# EAGLE design 6309 CPU Card v3 (EAGLE 4.16)
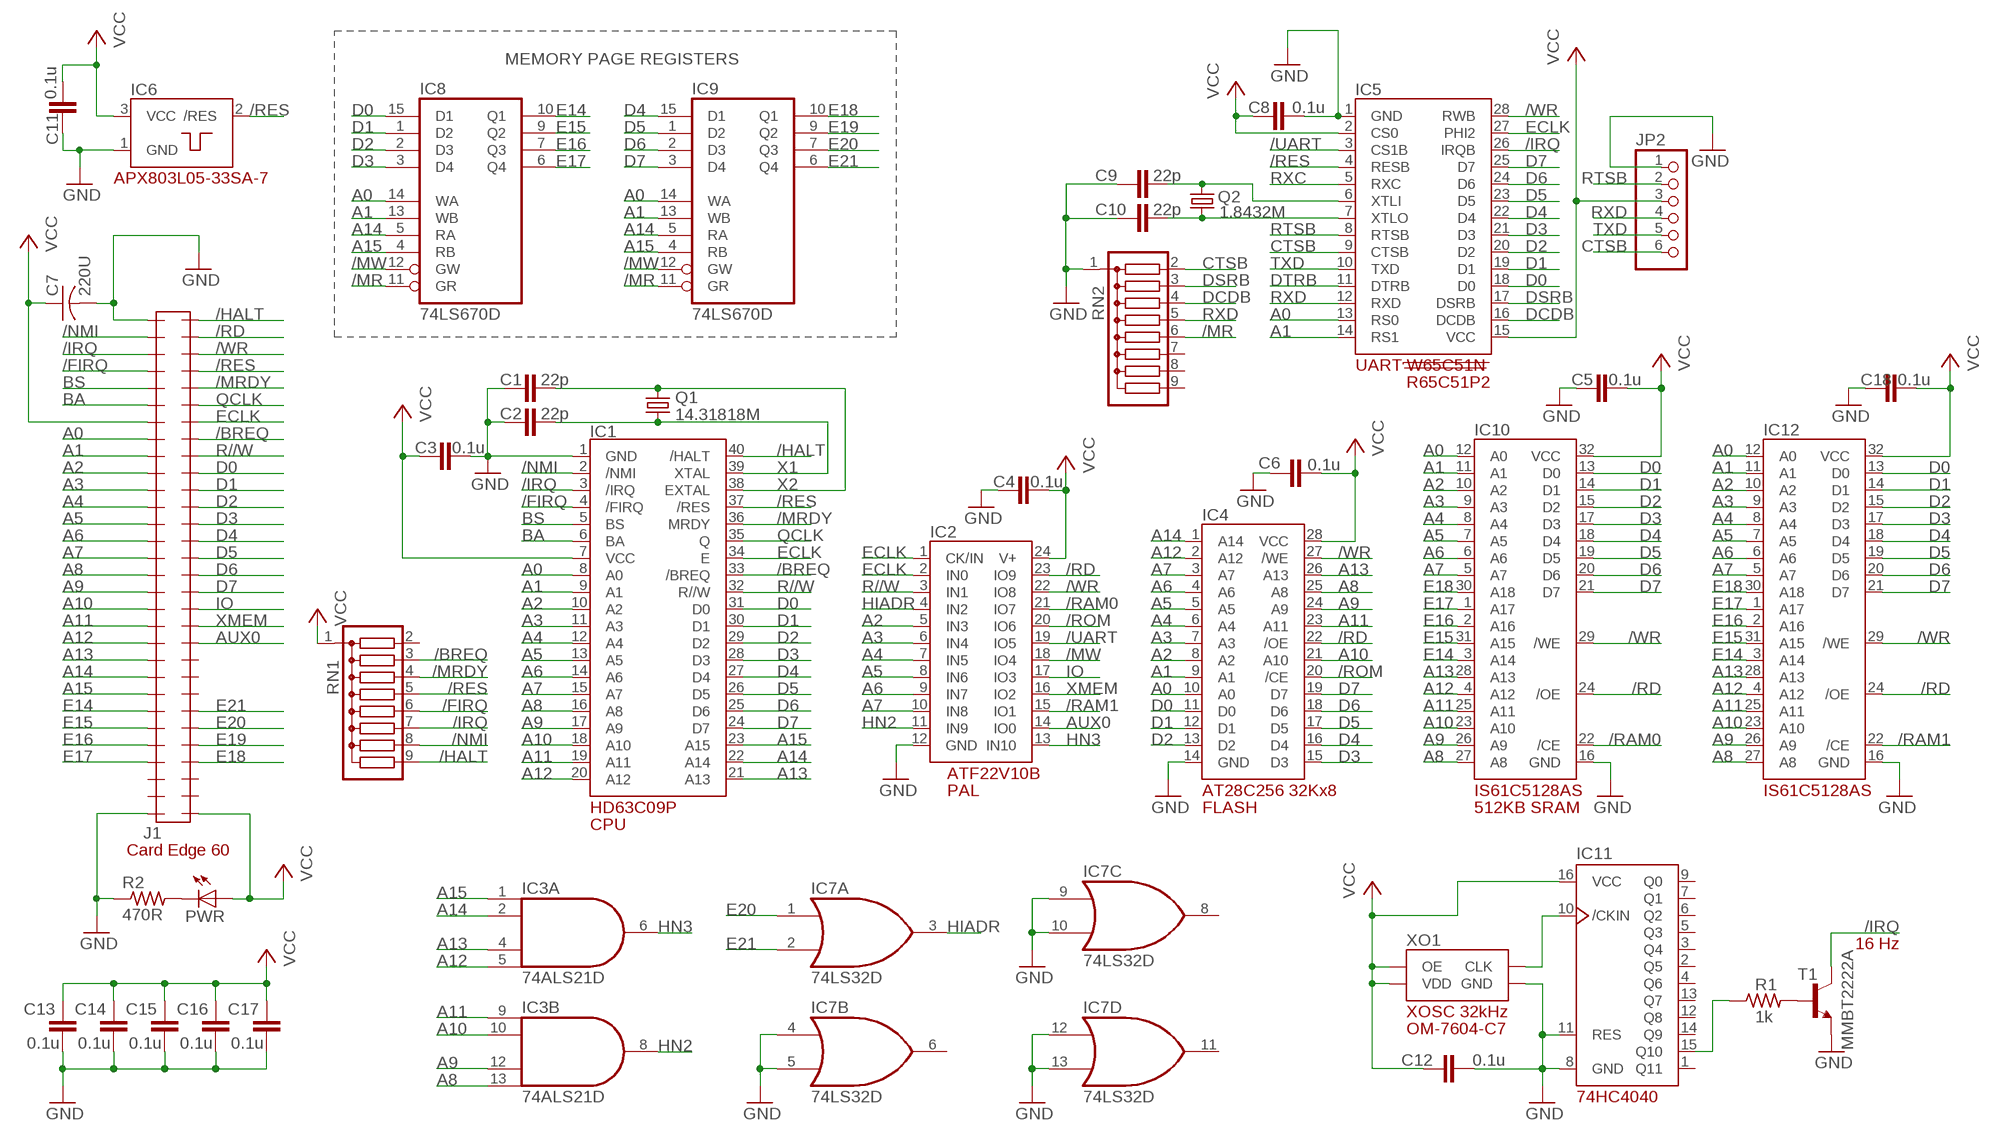
[diagram p0: schematic, sheet 1]

## Parts
C1  22p  C-EUC0603  [C0603]
C2  22p  C-EUC0603  [C0603]
C3  0.1u  C-EUC0603  [C0603]
C4  0.1u  C-EUC0603  [C0603]
C5  0.1u  C-EUC0603  [C0603]
C6  0.1u  C-EUC0603  [C0603]
C7  220U  C-US025-050X050  [C025-050X050]
C8  0.1u  C-EUC0603  [C0603]
C9  22p  C-EUC0603  [C0603]
C10  22p  C-EUC0603  [C0603]
C11  0.1u  C-EUC0603  [C0603]
C12  0.1u  C-EUC0603  [C0603]
C13  0.1u  C-EUC0603  [C0603]
C14  0.1u  C-EUC0603  [C0603]
C15  0.1u  C-EUC0603  [C0603]
C16  0.1u  C-EUC0603  [C0603]
C17  0.1u  C-EUC0603  [C0603]
C18  0.1u  C-EUC0603  [C0603]
IC1  HD63C09P  [DIL40]
IC2  PLD_ATF22V10B  [DIL24-3]
IC3  74ALS21D  [SO14]
IC4  EEP_32KX8_AT28C256  [DIL28-6]
IC5  UART_W65C51N  [DIL28-6]
IC6  POR_APX803L05-33SA-7  [SOT23]
IC7  74LS32D  [SO14]
IC8  74LS670D  [SO16]
IC9  74LS670D  [SO16]
IC10  IS61C5128AS  [SOIC32_11.3MM_WID]
IC11  74HC4040D  [SO16]
IC12  IS61C5128AS  [SOIC32_11.3MM_WID]
J1  CARDEDGE_2.54_60POS  [CARDEDGE_2.54_60POS]
JP2  PINHD-1X6  [1X06]
PWR  LED3MM  [LED3MM]
Q1  14.31818M  CRYSTALHC49S  [HC49/S]
Q2  1.8432M  CRYSTALHC49S  [HC49/S]
R1  1k  R-US_R0603  [R0603]
R2  470R  R-US_R0603  [R0603]
RN1  G08R  [SIL9]
RN2  G08R  [SIL9]
T1  MMBT2222A  MMBT2222ALT1-NPN-SOT23-BEC  [SOT23-BEC]
XO1  XODC_32KHZ_OM-7604-C7  [32K_XO_OM-7604-C7]

## Nets
/BREQ: IC1.33(/BREQ) J1.53 RN1.3
/FIRQ: IC1.4(/FIRQ) J1.4 RN1.6
/HALT: IC1.40(/HALT) J1.60 RN1.9
/IRQ: IC1.3(/IRQ) IC5.26(IRQB) J1.3 RN1.7 T1.C
/MR: IC8.11(GR) IC9.11(GR) RN2.6
/MRDY: IC1.36(MRDY) J1.56 RN1.4
/MW: IC2.18(IO4) IC8.12(GW) IC9.12(GW)
/NMI: IC1.2(/NMI) J1.2 RN1.8
/RAM0: IC2.21(IO7) IC10.22(/CE)
/RAM1: IC2.15(IO1) IC12.22(/CE)
/RD: IC2.23(IO9) IC4.22(/OE) IC10.24(/OE) IC12.24(/OE) J1.59
/RES: IC1.37(/RES) IC5.4(RESB) IC6.2(/RES) J1.57 RN1.5
/ROM: IC2.20(IO6) IC4.20(/CE)
/UART: IC2.19(IO5) IC5.3(CS1B)
/WR: IC2.22(IO8) IC4.27(/WE) IC5.28(RWB) IC10.29(/WE) IC12.29(/WE) J1.58
A0: IC1.8(A0) IC4.10(A0) IC5.13(RS0) IC8.14(WA) IC9.14(WA) IC10.12(A0) IC12.12(A0) J1.8
A1: IC1.9(A1) IC4.9(A1) IC5.14(RS1) IC8.13(WB) IC9.13(WB) IC10.11(A1) IC12.11(A1) J1.9
A2: IC1.10(A2) IC2.5(IN3) IC4.8(A2) IC10.10(A2) IC12.10(A2) J1.10
A3: IC1.11(A3) IC2.6(IN4) IC4.7(A3) IC10.9(A3) IC12.9(A3) J1.11
A4: IC1.12(A4) IC2.7(IN5) IC4.6(A4) IC10.8(A4) IC12.8(A4) J1.12
A5: IC1.13(A5) IC2.8(IN6) IC4.5(A5) IC10.7(A5) IC12.7(A5) J1.13
A6: IC1.14(A6) IC2.9(IN7) IC4.4(A6) IC10.6(A6) IC12.6(A6) J1.14
A7: IC1.15(A7) IC2.10(IN8) IC4.3(A7) IC10.5(A7) IC12.5(A7) J1.15
A8: IC1.16(A8) IC3.13(B:I3) IC4.25(A8) IC10.27(A8) IC12.27(A8) J1.16
A9: IC1.17(A9) IC3.12(B:I2) IC4.24(A9) IC10.26(A9) IC12.26(A9) J1.17
A10: IC1.18(A10) IC3.10(B:I1) IC4.21(A10) IC10.23(A10) IC12.23(A10) J1.18
A11: IC1.19(A11) IC3.9(B:I0) IC4.23(A11) IC10.25(A11) IC12.25(A11) J1.19
A12: IC1.20(A12) IC3.5(A:I3) IC4.2(A12) IC10.4(A12) IC12.4(A12) J1.20
A13: IC1.21(A13) IC3.4(A:I2) IC4.26(A13) IC10.28(A13) IC12.28(A13) J1.21
A14: IC1.22(A14) IC3.2(A:I1) IC4.1(A14) IC8.5(RA) IC9.5(RA) J1.22
A15: IC1.23(A15) IC3.1(A:I0) IC8.4(RB) IC9.4(RB) J1.23
AUX0: IC2.14(IO0) J1.41
BA: IC1.6(BA) J1.6
BS: IC1.5(BS) J1.5
CTSB: IC5.9(CTSB) JP2.6 RN2.2
D0: IC1.31(D0) IC4.11(D0) IC5.18(D0) IC8.15(D1) IC10.13(D0) IC12.13(D0) J1.51
D1: IC1.30(D1) IC4.12(D1) IC5.19(D1) IC8.1(D2) IC10.14(D1) IC12.14(D1) J1.50
D2: IC1.29(D2) IC4.13(D2) IC5.20(D2) IC8.2(D3) IC10.15(D2) IC12.15(D2) J1.49
D3: IC1.28(D3) IC4.15(D3) IC5.21(D3) IC8.3(D4) IC10.17(D3) IC12.17(D3) J1.48
D4: IC1.27(D4) IC4.16(D4) IC5.22(D4) IC9.15(D1) IC10.18(D4) IC12.18(D4) J1.47
D5: IC1.26(D5) IC4.17(D5) IC5.23(D5) IC9.1(D2) IC10.19(D5) IC12.19(D5) J1.46
D6: IC1.25(D6) IC4.18(D6) IC5.24(D6) IC9.2(D3) IC10.20(D6) IC12.20(D6) J1.45
D7: IC1.24(D7) IC4.19(D7) IC5.25(D7) IC9.3(D4) IC10.21(D7) IC12.21(D7) J1.44
DCDB: IC5.16(DCDB) RN2.4
DSRB: IC5.17(DSRB) RN2.3
DTRB: IC5.11(DTRB)
E14: IC8.10(Q1) IC10.3(A14) IC12.3(A14) J1.24
E15: IC8.9(Q2) IC10.31(A15) IC12.31(A15) J1.25
E16: IC8.7(Q3) IC10.2(A16) IC12.2(A16) J1.26
E17: IC8.6(Q4) IC10.1(A17) IC12.1(A17) J1.27
E18: IC9.10(Q1) IC10.30(A18) IC12.30(A18) J1.34
E19: IC9.9(Q2) J1.35
E20: IC7.1(A:I0) IC9.7(Q3) J1.36
E21: IC7.2(A:I1) IC9.6(Q4) J1.37
ECLK: IC1.34(E) IC2.1(CK/IN) IC2.2(IN0) IC5.27(PHI2) J1.54
GND [supply]: C1.1 C2.1 C3.2 C4.1 C5.1 C6.1 C7.2 C8.2 C9.1 C10.1 C11.2 C12.2 C13.2 C14.2 C15.2 C16.2 C17.2 C18.1 IC1.1(GND) IC2.12(GND) IC4.14(GND) IC5.1(GND) IC6.1(GND) IC7.4(B:I0) IC7.5(B:I1) IC7.9(C:I0) IC7.10(C:I1) IC7.12(D:I0) IC7.13(D:I1) IC10.16(GND) IC11.8(GND) IC11.11(RES) IC12.16(GND) J1.1 J1.30 JP2.1 R2.1 RN2.1 T1.E XO1.GND
HIADR: IC2.4(IN2) IC7.3(A:O)
HN2: IC2.11(IN9) IC3.8(B:O)
HN3: IC2.13(IN10) IC3.6(A:O)
IO: IC2.17(IO3) J1.43
N$1: R1.2 T1.B
N$2: PWR.K(C) R2.2
N$3: IC11.15(Q10) R1.1
N$5: IC11.10(/CKIN) XO1.CKOUT(CLK)
N$20: C9.2 IC5.6(XTLI) Q2.2
N$21: C10.2 IC5.7(XTLO) Q2.1
QCLK: IC1.35(Q) J1.55
R//W: IC1.32(R//W) IC2.3(IN1) J1.52
RTSB: IC5.8(RTSB) JP2.2
RXC: IC5.5(RXC)
RXD: IC5.12(RXD) JP2.4 RN2.5
TXD: IC5.10(TXD) JP2.5
VCC [supply]: C3.1 C4.2 C5.2 C6.2 C7.1 C8.1 C11.1 C12.1 C13.1 C14.1 C15.1 C16.1 C17.1 C18.2 IC1.7(VCC) IC2.24(V+) IC4.28(VCC) IC5.2(CS0) IC5.15(VCC) IC6.3(VCC) IC10.32(VCC) IC11.16(VCC) IC12.32(VCC) J1.7 J1.31 JP2.3 PWR.A RN1.1 XO1.OE XO1.VDD
X1: C2.2 IC1.39(XTAL) Q1.1
X2: C1.2 IC1.38(EXTAL) Q1.2
XMEM: IC2.16(IO2) J1.42
Unconnected: IC7.6(B:O) IC7.8(C:O) IC7.11(D:O) IC11.1(Q11) IC11.2(Q5) IC11.3(Q4) IC11.4(Q6) IC11.5(Q3) IC11.6(Q2) IC11.7(Q1) IC11.9(Q0) IC11.12(Q8) IC11.13(Q7) IC11.14(Q9) J1.28 J1.29 J1.32 J1.33 J1.38 J1.39 J1.40 RN1.2 RN2.7 RN2.8 RN2.9

## Notes on the sheet
- MEMORY PAGE REGISTERS
- R65C51P2
- PAL
- FLASH | 512KB SRAM
- CPU
- 16 Hz

## Power pins joined to a net without a drawn wire
GND: IC3.7(P:GND) IC7.7(P:GND) IC8.8(GND) IC9.8(GND)
VCC: IC3.14(P:VCC) IC7.14(P:VCC) IC8.16(VCC) IC9.16(VCC)

## Library data of the parts
C1-C6 C8-C18 = rcl:C-EU: CAPACITOR, European symbol
C7 = rcl:C-US: CAPACITOR, American symbol
IC1 = 07-Retrocomputing:HD63C09P
IC2 = 07-Retrocomputing:PLD_ATF22V10B
IC3 = 74xx-us:74*21: Dual 4-input AND gate
IC4 = 07-Retrocomputing:EEP_32KX8_AT28C256
IC5 = 07-Retrocomputing:UART_W65C51N
IC6 = 07-Retrocomputing:POR_APX803L05-33SA-7
IC7 = 74xx-us:74*32: Quad 2-input OR gate
IC8 IC9 = 74xx-us:74*670: 4 by 4 REGISTER FILES, 3-state
IC10 IC12 = 07-Retrocomputing:IS61C5128AS
IC11 = 07-Retrocomputing:74HC4040
J1 = 07-Retrocomputing:CARDEDGE_2.54_60POS
JP2 = pinhead:PINHD-1X6: PIN HEADER
PWR = led:LED: LED OSRAM: - CHIPLED LG R971, LG N971, LY N971, LG Q971, LY Q971, LO R971, LY R971 LH N974, LH R974 LS Q976, LO Q976, LY Q976 LO Q996 - Hyper CHIPLED LW Q18S LB Q993, LB Q99A, LB R99A - SideLED LS A670, LO A670, LY A670, LG A670, LP A670 LB A673, LV A673, LT A673, LW A673 LH A674 LY A675 LS A676, LA A676, LO A676, LY A676, LW A676 LS A679, LY A679, LG A679 - Hyper Micro SIDELED® LS Y876, LA Y876, LO Y876, LY Y876 LT Y87S - SmartLED LW L88C, LW L88S LB L89C, LB L89S, LG L890 LS L89K, LO L89K, LY L89K LS L896, LA L896, LO L896, LY L896 - TOPLED LS T670, LO T670, LY T670, LG T670, LP T670 LSG T670, LSP T670, LSY T670, LOP T670, LYG T670 LG T671, LOG T671, LSG T671 LB T673, LV T673, LT T673, LW T673 LH T674 LS T676, LA T676, LO T676, LY T676, LB T676, LH T676, LSB T676, LW T676 LB T67C, LV T67C, LT T67C, LS T67K, LO T67K, LY T67K, LW E67C LS E67B, LA E67B, LO E67B, LY E67B, LB E67C, LV E67C, LT E67C LW T67C LS T679, LY T679, LG T679 LS T770, LO T770, LY T770, LG T770, LP T770 LB T773, LV T773, LT T773, LW T773 LH T774 LS E675, LA E675, LY E675, LS T675 LS T776, LA T776, LO T776, LY T776, LB T776 LHGB T686 LT T68C, LB T68C - Hyper Mini TOPLED® LB M676 - Mini TOPLED Santana® LG M470 LS M47K, LO M47K, LY M47K Source: http://www.osram.convergy.de - LUMILED® LXK2-PW12-R00, LXK2-PW12-S00, LXK2-PW14-U00, LXK2-PW14-V00 LXK2-PM12-R00, LXK2-PM12-S00, LXK2-PM14-U00 LXK2-PE12-Q00, LXK2-PE12-R00, LXK2-PE12-S00, LXK2-PE14-T00, LXK2-PE14-U00 LXK2-PB12-K00, LXK2-PB12-L00, LXK2-PB12-M00, LXK2-PB14-N00, LXK2-PB14-P00, LXK2-PB14-Q00 LXK2-PR12-L00, LXK2-PR12-M00, LXK2-PR14-Q00, LXK2-PR14-R00 LXK2-PD12-Q00, LXK2-PD12-R00, LXK2-PD12-S00 LXK2-PH12-R00, LXK2-PH12-S00 LXK2-PL12-P00, LXK2-PL12-Q00, LXK2-PL12-R00 Source: www.luxeon.com
Q1 Q2 = crystal:CRYSTAL: CRYSTAL
R1 R2 = rcl:R-US_: RESISTOR, American symbol
RN1 RN2 = resistor-sil:G08R: SIL RESISTOR
T1 = transistor:*-NPN-: NPN Transistror
XO1 = 07-Retrocomputing:XODC_32KHZ_OM-7604-C7

## Net classes
0 default: width 0.203 mm, drill 0.203 mm, clearance 0.254 mm
1 supply: width 0.61 mm, drill 0.203 mm, clearance 0.305 mm

## Board
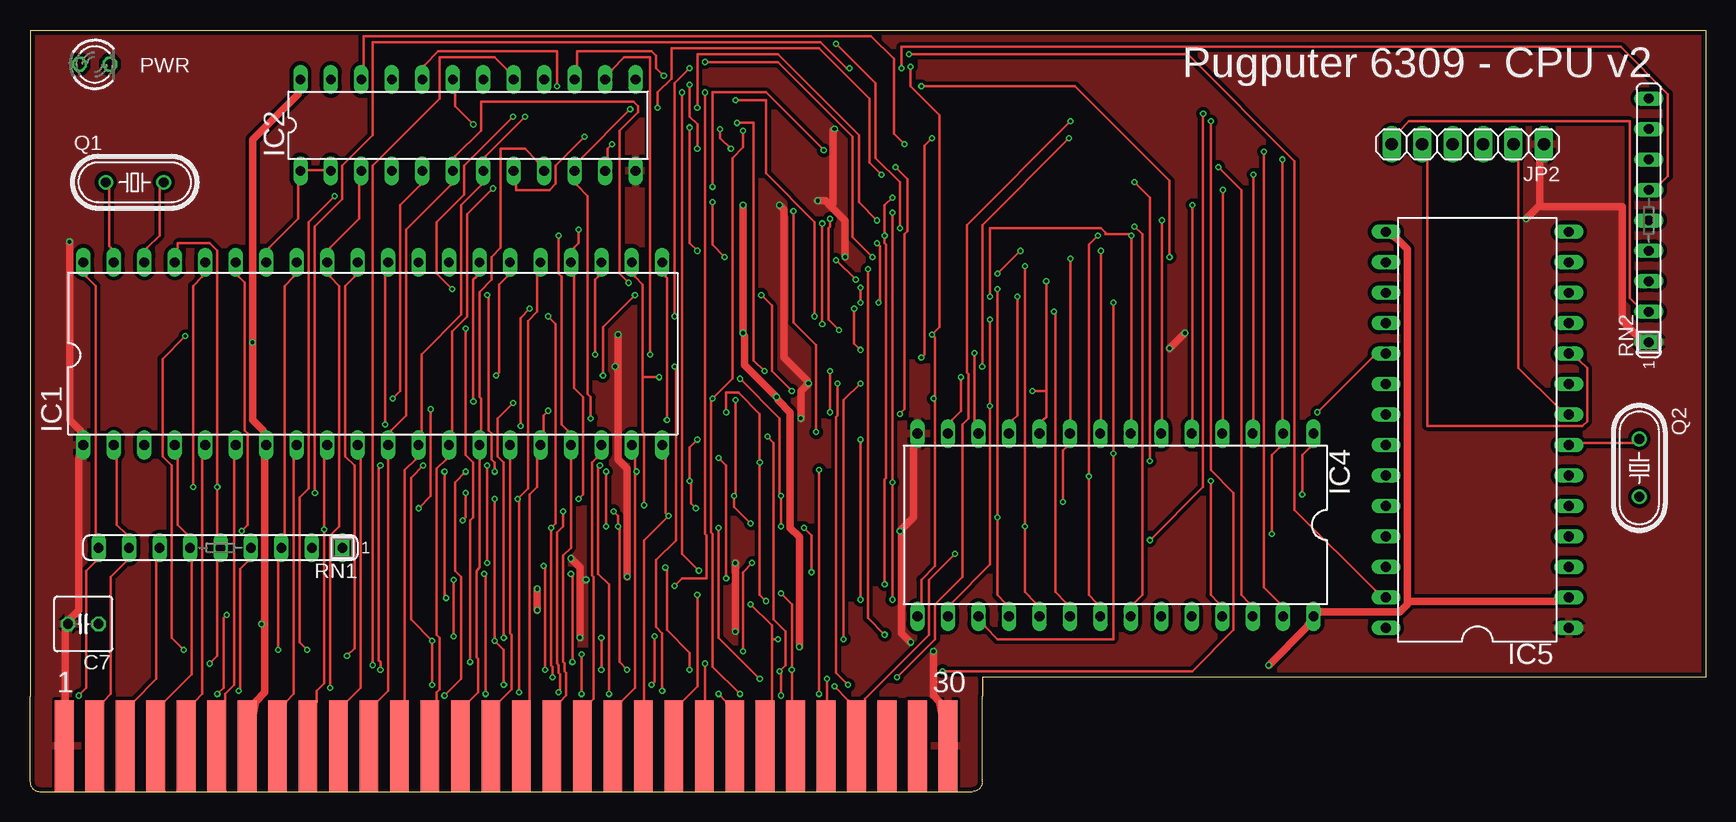
[diagram p1: board, top side]
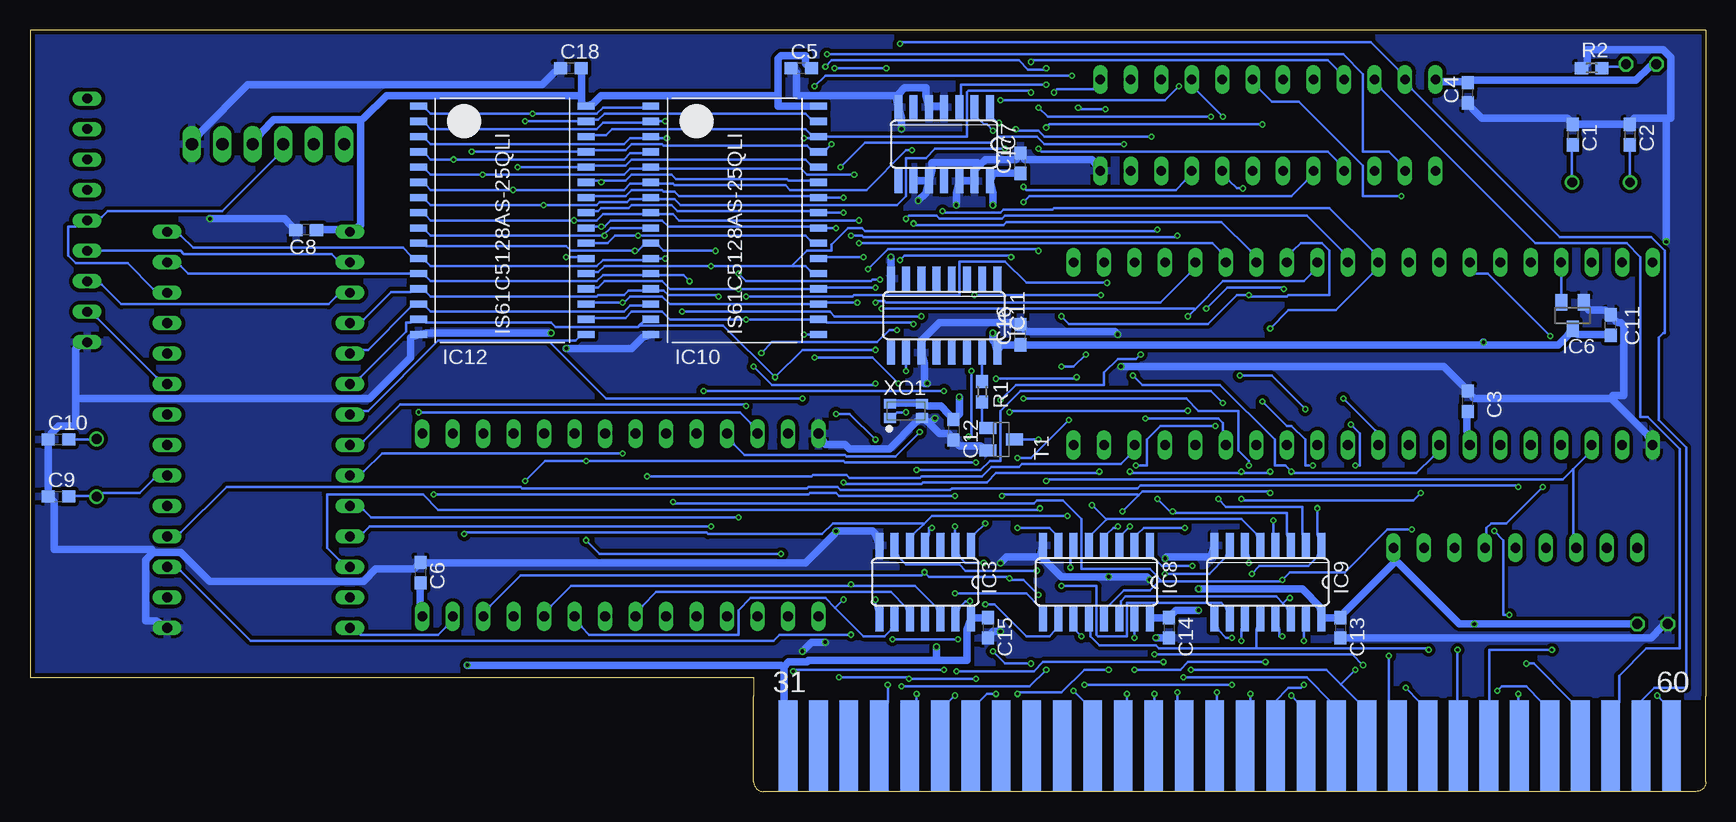
[diagram p2: board, bottom side, seen from below]

Size 139.7 x 63.5 mm. Coordinates in mm from the lower left corner, seen from the top.
Outline: 0,7.94 0,63.5 139.7,63.5 139.7,9.53 79.38,9.53 79.38,7.94
Copper layers (1*16): Top 0.0356mm / dielectric 1.6mm / Bottom 0.0356mm
Design rules "oshpark-2layer": minimum track width 6mil, minimum drill 10mil, track to track 6mil, track to pad 6mil, pad to pad 6mil, via to via 6mil, smd to smd 6mil, copper to edge 15mil, drill to drill 6mil, minimum pad ring 5mil, minimum via ring 5mil, stop-mask expansion 2.5mil, vias tented up to drill 0mil, thermal gap 10mil

### Footprints (pad centres in the part's own frame; a part is rotated, then mirrored left to right if it is on the bottom)
C0603 = smd 1.1 x 1: 1 -0.85,0; 2 0.85,0
C025-050X050 = drill 0.813 octagon: 1 -1.27,0; 2 1.27,0
DIL40 = drill 0.813 long: 1 -24.13,-7.62; 2 -21.59,-7.62; 3 -19.05,-7.62; 4 -16.51,-7.62; 5 -13.97,-7.62; 6 -11.43,-7.62; 7 -8.89,-7.62; 8 -6.35,-7.62; 9 -3.81,-7.62; 10 -1.27,-7.62; 11 1.27,-7.62; 12 3.81,-7.62; 13 6.35,-7.62; 14 8.89,-7.62; 15 11.43,-7.62; 16 13.97,-7.62; 17 16.51,-7.62; 18 19.05,-7.62; 19 21.59,-7.62; 20 24.13,-7.62; 21 24.13,7.62; 22 21.59,7.62; 23 19.05,7.62; 24 16.51,7.62; 25 13.97,7.62; 26 11.43,7.62; 27 8.89,7.62; 28 6.35,7.62; 29 3.81,7.62; 30 1.27,7.62; 31 -1.27,7.62; 32 -3.81,7.62; 33 -6.35,7.62; 34 -8.89,7.62; 35 -11.43,7.62; 36 -13.97,7.62; 37 -16.51,7.62; 38 -19.05,7.62; 39 -21.59,7.62; 40 -24.13,7.62
DIL24-3 = drill 0.813 long: 1 -13.97,-3.81; 2 -11.43,-3.81; 3 -8.89,-3.81; 4 -6.35,-3.81; 5 -3.81,-3.81; 6 -1.27,-3.81; 7 1.27,-3.81; 8 3.81,-3.81; 9 6.35,-3.81; 10 8.89,-3.81; 11 11.43,-3.81; 12 13.97,-3.81; 13 13.97,3.81; 14 11.43,3.81; 15 8.89,3.81; 16 6.35,3.81; 17 3.81,3.81; 18 1.27,3.81; 19 -1.27,3.81; 20 -3.81,3.81; 21 -6.35,3.81; 22 -8.89,3.81; 23 -11.43,3.81; 24 -13.97,3.81
SO14 = smd 0.66 x 2.032: 1 -3.81,-3.073; 2 -2.54,-3.073; 3 -1.27,-3.073; 4 0,-3.073; 5 1.27,-3.073; 6 2.54,-3.073; 7 3.81,-3.073; 8 3.81,3.073; 9 2.54,3.073; 10 1.27,3.073; 11 0,3.073; 12 -1.27,3.073; 13 -2.54,3.073; 14 -3.81,3.073
DIL28-6 = drill 0.813 long: 1 -16.51,-7.62; 2 -13.97,-7.62; 3 -11.43,-7.62; 4 -8.89,-7.62; 5 -6.35,-7.62; 6 -3.81,-7.62; 7 -1.27,-7.62; 8 1.27,-7.62; 9 3.81,-7.62; 10 6.35,-7.62; 11 8.89,-7.62; 12 11.43,-7.62; 13 13.97,-7.62; 14 16.51,-7.62; 15 16.51,7.62; 16 13.97,7.62; 17 11.43,7.62; 18 8.89,7.62; 19 6.35,7.62; 20 3.81,7.62; 21 1.27,7.62; 22 -1.27,7.62; 23 -3.81,7.62; 24 -6.35,7.62; 25 -8.89,7.62; 26 -11.43,7.62; 27 -13.97,7.62; 28 -16.51,7.62
SOT23 = smd 1 x 1.4: 1 -0.95,-1.1; 2 0.95,-1.1; 3 0,1.1
SO16 = smd 0.66 x 2.032: 1 -4.445,-3.073; 2 -3.175,-3.073; 3 -1.905,-3.073; 4 -0.635,-3.073; 5 0.635,-3.073; 6 1.905,-3.073; 7 3.175,-3.073; 8 4.445,-3.073; 9 4.445,3.073; 10 3.175,3.073; 11 1.905,3.073; 12 0.635,3.073; 13 -0.635,3.073; 14 -1.905,3.073; 15 -3.175,3.073; 16 -4.445,3.073
SOIC32_11.3MM_WID = smd 1.4 x 0.6: 1 -6.985,9.525; 2 -6.985,8.255; 3 -6.985,6.985; 4 -6.985,5.715; 5 -6.985,4.445; 6 -6.985,3.175; 7 -6.985,1.905; 8 -6.985,0.635; 9 -6.985,-0.635; 10 -6.985,-1.905; 11 -6.985,-3.175; 12 -6.985,-4.445; 13 -6.985,-5.715; 14 -6.985,-6.985; 15 -6.985,-8.255; 16 -6.985,-9.525; 17 6.985,-9.525; 18 6.985,-8.255; 19 6.985,-6.985; 20 6.985,-5.715; 21 6.985,-4.445; 22 6.985,-3.175; 23 6.985,-1.905; 24 6.985,-0.635; 25 6.985,0.635; 26 6.985,1.905; 27 6.985,3.175; 28 6.985,4.445; 29 6.985,5.715; 30 6.985,6.985; 31 6.985,8.255; 32 6.985,9.525
CARDEDGE_2.54_60POS = smd 1.556 x 7.62: 1 -36.83,3.81; 2 -34.29,3.81; 3 -31.75,3.81; 4 -29.21,3.81; 5 -26.67,3.81; 6 -24.13,3.81; 7 -21.59,3.81; 8 -19.05,3.81; 9 -16.51,3.81; 10 -13.97,3.81; 11 -11.43,3.81; 12 -8.89,3.81; 13 -6.35,3.81; 14 -3.81,3.81; 15 -1.27,3.81; 16 1.27,3.81; 17 3.81,3.81; 18 6.35,3.81; 19 8.89,3.81; 20 11.43,3.81; 21 13.97,3.81; 22 16.51,3.81; 23 19.05,3.81; 24 21.59,3.81; 25 24.13,3.81; 26 26.67,3.81; 27 29.21,3.81; 28 31.75,3.81; 29 34.29,3.81; 30 36.83,3.81 | smd 1.556 x 7.62 bottom: 31 36.83,3.81; 32 34.29,3.81; 33 31.75,3.81; 34 29.21,3.81; 35 26.67,3.81; 36 24.13,3.81; 37 21.59,3.81; 38 19.05,3.81; 39 16.51,3.81; 40 13.97,3.81; 41 11.43,3.81; 42 8.89,3.81; 43 6.35,3.81; 44 3.81,3.81; 45 1.27,3.81; 46 -1.27,3.81; 47 -3.81,3.81; 48 -6.35,3.81; 49 -8.89,3.81; 50 -11.43,3.81; 51 -13.97,3.81; 52 -16.51,3.81; 53 -19.05,3.81; 54 -21.59,3.81; 55 -24.13,3.81; 56 -26.67,3.81; 57 -29.21,3.81; 58 -31.75,3.81; 59 -34.29,3.81; 60 -36.83,3.81
1X06 = drill 1.016 long: 1 -6.35,0; 2 -3.81,0; 3 -1.27,0; 4 1.27,0; 5 3.81,0; 6 6.35,0
LED3MM = drill 0.813 octagon: A -1.27,0; K 1.27,0
HC49/S = drill 0.813 round: 1 -2.413,0; 2 2.413,0
R0603 = smd 1.1 x 1: 1 -0.85,0; 2 0.85,0
SIL9 = drill 0.813 long: 1 -10.16,0; 2 -7.62,0; 3 -5.08,0; 4 -2.54,0; 5 0,0; 6 2.54,0; 7 5.08,0; 8 7.62,0; 9 10.16,0
SOT23-BEC = smd 1 x 1.4: B -0.95,-1.1; C 0,1.1; E 0.95,-1.1
32K_XO_OM-7604-C7 = smd 1 x 0.8: CKOUT -1.35,-0.6; GND 1.35,-0.6; OE 1.35,0.6; VDD -1.35,0.6

### Placement (x,y rotation side)
C1  11.11,54.77 270 bottom
C2  6.35,54.77 270 bottom
C3  19.84,32.54 90 bottom
C4  19.84,58.26 90 bottom
C5  75.41,60.33 0 bottom
C6  107.16,18.26 270 bottom
C7  4.45,13.97 180 top
C8  116.68,46.83 180 bottom
C9  137.32,24.61 0 bottom
C10  137.32,29.37 0 bottom
C11  7.94,38.89 90 bottom
C12  62.71,30.16 270 bottom
C13  30.48,13.65 270 bottom
C14  44.77,13.65 270 bottom
C15  59.85,13.65 270 bottom
C16  57.15,38.1 90 bottom
C17  57.15,52.39 90 bottom
C18  94.61,60.33 0 bottom
IC1  28.57,36.51 0 top
IC2  36.51,55.56 0 top
IC3  65.09,17.46 180 bottom
IC4  90.49,22.23 180 top
IC5  120.65,30.16 90 top
IC6  11.11,39.69 180 bottom
IC7  63.5,53.98 180 bottom
IC8  50.8,17.46 180 bottom
IC9  36.51,17.46 180 bottom
IC10  80.96,47.62 0 bottom
IC11  63.5,39.69 180 bottom
IC12  100.33,47.62 0 bottom
J1  39.69,0 0 top
JP2  119.86,53.98 180 top
PWR  5.4,60.64 0 top
Q1  8.73,50.8 0 top
Q2  134.14,26.99 270 top
R1  60.33,33.34 270 bottom
R2  9.53,60.33 0 bottom
RN1  15.88,20.32 180 top
RN2  134.94,47.62 90 top
T1  58.74,29.37 270 bottom
XO1  66.67,31.75 0 bottom

### Tracks (layer width: path | path; a pad name or v marks a point on that pad's centre or on a via)
/BREQ  (via drill 0.25)
  Top 0.203: IC1.33 21.97,42.93 21.21,42.16 21.21,21.46 RN1.3 20.7,19.18 v20.7,11.81
  Bottom 0.203: v20.7,11.81 20.7,7.49 J1.53
/FIRQ
  Top 0.203: IC1.4 12.32,27.69 12.32,22.23 13.08,21.46 RN1.6 13.46,19.18 13.46,9.78 11.18,7.49 J1.4
/HALT  (via drill 0.25)
  Top 0.203: IC1.40 4.7,42.93 5.46,42.16 5.46,21.46 RN1.9 5.46,19.18 4.7,18.41 4.7,8.64 v4.06,8
  Bottom 0.203: v4.06,8 3.56,7.49 J1.60
/IRQ  (via drill 0.25)
  Top 0.203: v55.63,29.34 54.99,28.7 v54.99,25.91 55.12,25.78 55.12,24 v55.5,23.62 | J1.3 8.64,7.49 10.54,9.4 10.54,19.18 RN1.7
  Bottom 0.203: v55.63,29.34 57.02,29.34 T1.C | v54.99,25.91 54.86,26.04 11.94,26.04 11.11,26.86 | 11.11,26.86 10.03,27.94 IC1.3 | RN1.7 11.05,21.46 11.05,26.8 11.11,26.86 | v55.5,23.62 55.63,23.5 105.66,23.5 106.93,24.77 114.94,24.77 114.94,20.32 113.92,19.3 IC5.26
/MR  (via drill 0.25)
  Top 0.203: v39.5,8.89 39.5,11.81 v38.73,12.57 v38.73,24.38 | v51.82,8.89 52.07,9.14 v52.07,12.95 | v72.64,60.33 72.64,62.1 132.59,62.1 136.53,58.17 136.53,51.31 135.89,50.67 RN2.6 | v68.33,60.33 68.07,60.33 65.91,62.48 28.57,62.48 28.57,54.74 26.04,52.2 26.04,49.4 23.75,47.12 v23.75,24.89
  Bottom 0.203: v38.73,12.57 38.73,13.46 IC9.11 | v39.5,8.89 v51.82,8.89 | v52.07,12.95 52.58,13.46 IC8.11 | v68.33,60.33 v72.64,60.33 | v23.75,24.89 24.38,24.26 38.61,24.26 v38.73,24.38
/MRDY  (via drill 0.25)
  Top 0.203: v17.4,8.38 17.53,8.51 17.53,18.54 18.16,19.18 RN1.4 | v13.59,25.4 13.59,42.16 14.35,42.93 IC1.36
  Bottom 0.203: v17.4,8.38 17.02,8.76 14.99,8.76 13.72,7.49 J1.56 | v13.59,25.4 16.64,22.35 17.91,22.35 18.29,21.97 18.29,21.46 RN1.4
/MW  (via drill 0.25)
  Top 0.203: v25.4,49.66 23.24,47.5 23.24,25.27 22.48,24.51 22.48,12.45 v23.11,11.81
  Bottom 0.203: 37.47,11.94 37.47,13.46 IC9.12 | 37.47,11.94 45.59,11.94 45.85,12.19 50.55,12.19 51.31,12.95 51.31,13.46 IC8.12 | v25.4,49.66 28.57,49.66 28.57,52.2 33.91,57.53 36.2,57.53 37.21,58.55 IC2.18 | v23.11,11.81 23.24,11.94 37.47,11.94
/NMI
  Top 0.203: IC1.2 7.24,27.69 7.24,22.23 8,21.46 RN1.8 8,19.18 6.73,17.91 6.73,8.13 6.1,7.49 J1.2
/RAM0  (via drill 0.25)
  Top 0.203: v70.23,44.58 68.58,46.23 68.58,54.61 62.36,60.83 v56.26,60.83
  Bottom 0.203: v70.23,44.58 73.28,44.58 IC10.22 | v56.26,60.83 56.13,60.96 31.5,60.96 30.73,60.2 IC2.21
/RAM1  (via drill 0.25)
  Top 0.203: v95,44.58 95,50.93 87.12,58.8 v74.3,58.8 | v52.83,59.69 52.2,60.33 52.2,61.34 51.82,61.72 45.59,61.72 45.59,60.58 IC2.15
  Bottom 0.203: v95,44.58 93.98,44.58 IC12.22 | v74.3,58.8 73.41,59.69 v52.83,59.69
/RD  (via drill 0.25)
  Top 0.203: v92.08,47.12 92.71,46.48 92.71,16.38 92.08,15.75 IC4.22 | v72.52,46.99 72.52,50.8 70.48,52.83 70.48,59.05 v67.18,62.36
  Bottom 0.203: IC12.24 92.71,47.12 v92.08,47.12 91.82,47.12 91.31,47.62 87,47.62 86.49,47.12 74.68,47.12 IC10.24 v72.52,46.99 | J1.59 5.46,7.49 4.32,8.64 1.65,8.64 1.65,28.7 3.94,30.99 3.94,37.85 3.56,38.23 3.43,38.23 3.43,45.09 4.57,46.23 12.19,46.23 24.51,58.55 IC2.23 25.65,60.2 27.94,62.48 67.06,62.48 v67.18,62.36
/RES  (via drill 0.25)
  Top 0.203: IC1.37 12.32,45.34 12.32,45.72 14.99,45.72 15.62,45.09 v15.62,25.4 15.62,21.46 RN1.5 15.62,19.18 15.62,11.3 v14.99,10.67
  Bottom 0.203: IC6.2 12.06,41.4 IC1.37 | v15.62,25.4 15.75,25.53 47.12,25.53 47.37,25.27 62.87,25.27 62.99,25.15 72.14,25.15 72.39,25.4 74.8,25.4 74.93,25.27 98.68,25.27 98.81,25.4 123.32,25.4 127.13,21.59 IC5.4 | v14.99,10.67 14.35,10.67 11.18,7.49 J1.57
/ROM  (via drill 0.25)
  Top 0.203: v43.94,58.8 43.94,61.72 34.04,61.72 32.89,60.58 IC2.20 | v58.8,57.66 61.34,57.66 61.34,51.56 65.41,47.5 v65.41,39.62 | v85.34,40.01 85.47,39.88 85.47,16.64 86.36,15.75 IC4.20
  Bottom 0.203: v43.94,58.8 45.09,57.66 v58.8,57.66 | v65.41,39.62 72.64,39.62 73.03,40.01 v85.34,40.01
/UART  (via drill 0.25)
  Top 0.203: v71.25,13.08 69.85,14.48 v69.85,43.56 | v55.63,45.09 54.99,45.72 v54.99,55.37 | v36.96,55.63 35.43,57.15 35.43,58.17 IC2.19
  Bottom 0.203: v71.25,13.08 77.22,13.08 77.72,12.57 121.28,12.57 127.13,18.41 IC5.3 | v69.85,43.56 68.2,45.21 55.75,45.21 v55.63,45.09 | v54.99,55.37 54.74,55.63 v36.96,55.63
/WR  (via drill 0.25)
  Top 0.203: v102.87,53.34 102.87,17.02 104.14,15.75 IC4.27 | v72.9,53.98 72.01,54.86 72.01,61.09 70.1,62.99 27.81,62.99 27.81,60.58 IC2.22
  Bottom 0.203: IC4.27 105.03,13.72 105.66,13.08 112.14,13.08 IC5.28 | v102.87,53.34 IC12.29 92.71,53.47 90.04,53.47 89.53,53.98 87,53.98 86.87,53.85 74.93,53.85 74.68,53.59 IC10.29 73.28,53.59 v72.9,53.98 | IC2.22 27.05,58.55 14.22,45.72 6.6,45.72 5.46,44.58 5.46,31.24 4.83,31.24 2.16,28.57 2.16,11.94 4.95,11.94 7.24,9.65 7.24,7.49 J1.58
A0  (via drill 0.25)
  Top 0.203: 84.71,33.4 v84.71,42.55 | 84.71,33.4 84.71,31.24 84.45,30.99 IC4.10 | IC1.8 21.97,27.69 21.97,8.13 21.34,7.49 J1.8 | v34.67,16.13 34.54,16.26 v34.54,26.67 | v83.57,33.4 84.71,33.4 | v63.5,33.4 61.85,35.05 61.85,40.51 v60.96,41.4 | v50.42,41.4 47.75,38.73 v47.75,34.67
  Bottom 0.203: v84.71,42.55 85.22,43.05 87.25,43.05 IC10.12 88.65,43.05 91.95,43.05 92.46,42.55 106.3,42.55 106.68,42.93 IC12.12 126.49,43.18 127.13,43.81 IC5.13 | 35.24,15.68 35.81,16.26 48.39,16.26 48.77,15.88 48.77,15.37 IC8.14 | 35.24,15.68 34.92,15.37 IC9.14 | v34.67,16.13 34.8,16.13 35.24,15.68 | IC1.8 22.73,27.94 24.13,26.54 34.42,26.54 v34.54,26.67 35.05,27.18 35.94,27.18 35.94,29.34 40.51,33.91 46.99,33.91 v47.75,34.67 | v63.5,33.4 v83.57,33.4 | v50.42,41.4 v60.96,41.4
A1  (via drill 0.25)
  Top 0.203: v86.74,44.45 86.74,30.99 IC4.9 86.36,28.7 86.11,28.45 v86.11,24.13 | v35.31,17.65 v35.31,12.95 | IC1.9 24.51,27.69 v24.51,21.84 24.51,9.02 23.88,8.38 23.88,7.49 J1.9
  Bottom 0.203: v86.74,44.45 IC10.11 88.65,44.32 91.95,44.32 92.46,43.81 106.3,43.81 106.68,44.2 IC12.11 107.95,44.7 108.58,45.34 126.11,45.34 127.13,46.35 IC5.14 | v35.31,12.95 35.56,12.95 35.56,13.46 IC9.13 | 45.34,17.53 45.59,17.53 46.35,16.76 48.51,16.76 49.91,15.37 IC8.13 | 45.34,17.53 35.43,17.53 v35.31,17.65 34.67,18.29 30.1,18.29 26.54,21.84 v24.51,21.84 | v86.11,24.13 85.98,24 56.01,24 55.75,24.26 53.59,24.26 52.07,22.73 52.07,18.54 46.35,18.54 45.34,17.53
A2  (via drill 0.25)
  Top 0.203: v89.28,45.09 89.28,30.99 IC4.8 | IC1.10 27.56,27.69 27.56,8.64 26.42,7.49 J1.10 | v30.23,32.77 30.86,33.4 30.86,48.9 32.51,50.55 IC2.5 | v80.64,43.18 v82.55,45.09 | v67.18,44.32 v68.83,42.67 | v57.91,44.58 56.9,45.59 v56.9,49.15
  Bottom 0.203: IC12.10 106.68,45.47 95,45.47 94.61,45.09 v89.28,45.09 89.03,45.09 88.65,45.47 IC10.10 87.25,45.47 86.87,45.09 v82.55,45.09 | v30.23,32.77 27.56,30.1 IC1.10 | v80.64,43.18 80.01,42.55 69.6,42.55 69.47,42.67 v68.83,42.67 | v67.18,44.32 66.8,44.7 58.04,44.7 v57.91,44.58 | v56.9,49.15 56.39,49.66 34.54,49.66 33.27,50.93 IC2.5
A3  (via drill 0.25)
  Top 0.203: IC4.7 91.82,30.99 v91.82,46.35 91.69,46.48 89.66,46.48 89.66,46.61 89.28,46.99 80.01,46.99 v80.01,41.27 | J1.11 28.96,7.49 29.84,8.38 IC1.11 30.1,30.1 31.37,31.37 31.37,46.86 35.05,50.55 IC2.6 35.43,52.96 37.59,55.12 37.59,57.53 50.29,57.53 50.67,57.15 50.67,56.64 49.15,55.12 49.15,43.18 v49.91,42.42
  Bottom 0.203: 91.89,46.42 91.95,46.35 106.3,46.35 106.68,46.74 IC12.9 | 91.89,46.42 91.31,46.99 IC10.9 | v91.82,46.35 91.89,46.42 | v80.01,41.27 71.12,41.27 70.99,41.4 62.23,41.4 62.23,44.2 58.42,44.2 56.64,42.42 v49.91,42.42
A4  (via drill 0.25)
  Top 0.203: v94.36,47.62 94.36,30.99 IC4.6 | J1.12 31.24,7.49 31.24,26.8 32.13,27.69 IC1.12 32.64,30.1 32.64,36.45 35.94,39.75 35.94,48.9 37.59,50.55 IC2.7 37.97,52.96 v41.27,56.26 | v70.61,47.62 69.09,49.15 69.09,54.74 62.36,61.47 55.63,61.47 v55.63,57.02
  Bottom 0.203: IC12.8 106.68,48.01 106.3,47.62 v94.36,47.62 92.46,47.62 91.95,48.13 88.65,48.13 IC10.8 87.25,48.13 86.11,48.13 85.6,47.62 v70.61,47.62 | v55.63,57.02 54.86,56.26 v41.27,56.26
A5  (via drill 0.25)
  Top 0.203: v96.9,48.9 96.9,30.99 IC4.5 | J1.13 33.91,7.49 33.91,8.26 34.16,8.51 34.16,12.83 33.91,13.08 33.91,26.92 34.67,27.69 IC1.13 35.18,30.1 35.18,38.35 36.45,39.62 36.45,48.13 v38.61,50.29 | v58.42,53.59 57.53,54.48 v57.53,55.24 | v46.23,54.61 43.81,52.2 43.81,50.67 43.31,50.16 40.51,50.16 40.51,50.55 IC2.8
  Bottom 0.203: IC12.7 106.68,49.28 106.3,48.9 v96.9,48.9 92.46,48.9 92.2,49.15 89.92,49.15 89.66,49.4 88.65,49.4 IC10.7 87.25,49.4 85.98,49.4 85.47,48.9 67.44,48.9 66.67,49.66 66.67,52.83 65.02,52.83 64.26,53.59 v58.42,53.59 | v38.61,50.29 39.12,50.29 39.75,50.93 IC2.8 | v57.53,55.24 57.4,55.12 55.63,55.12 55.12,54.61 v46.23,54.61
A6  (via drill 0.25)
  Top 0.203: v99.44,50.16 99.44,30.99 IC4.4 | J1.14 36.58,7.49 37.34,8.26 37.34,11.05 37.21,11.18 37.21,18.41 37.47,18.67 IC1.14 37.59,30.1 37.59,32.77 37.47,32.89 37.47,41.66 38.48,42.67 38.48,44.58 39.24,45.34 39.24,53.59 41.27,53.59 42.29,52.58 IC2.9 | v66.17,53.47 61.34,58.29 56.9,58.29 v56.9,50.42
  Bottom 0.203: IC12.6 106.68,50.55 106.3,50.16 v99.44,50.16 90.17,50.16 89.66,50.67 88.65,50.67 IC10.6 87.25,50.67 86.11,50.67 85.98,50.55 76.71,50.55 76.33,50.16 69.98,50.16 66.67,53.47 v66.17,53.47 | v56.9,50.42 56.64,50.16 44.2,50.16 43.43,50.93 IC2.9
A7  (via drill 0.25)
  Top 0.203: v101.98,51.44 101.98,30.99 IC4.3 | IC1.15 40.01,13.21 40.13,13.08 40.13,8.51 39.12,7.49 J1.15 | v46.74,31.11 46.74,32.89 46.48,33.15 46.48,49.66 45.59,50.55 IC2.10 45.85,52.7 v50.04,56.9 | v70.99,51.44 69.98,52.45 69.98,57.78 65.79,61.98 53.47,61.98 53.47,59.44 52.32,58.29 v52.32,57.02
  Bottom 0.203: IC12.5 106.68,51.82 106.3,51.44 v101.98,51.44 90.17,51.44 89.66,51.94 88.65,51.94 IC10.5 87.25,51.94 75.44,51.94 74.93,51.44 v70.99,51.44 | v46.74,31.11 40.64,31.11 40.26,30.73 40.26,30.1 IC1.15 | v52.32,57.02 52.2,56.9 v50.04,56.9
A8  (via drill 0.25)
  Top 0.203: v61.34,15.88 60.83,16.38 v60.83,27.43 60.83,31.5 59.05,33.27 58.04,33.27 v58.04,31.62 | v43.18,31.75 42.8,31.37 42.8,30.1 IC1.16 42.29,27.69 42.29,25.4 41.66,24.77 41.66,7.49 J1.16 | v98.42,25.91 98.42,16.38 99.06,15.75 IC4.25 | v92.08,50.8 93.34,49.53 v93.34,27.56
  Bottom 0.203: 92.08,50.93 92.71,50.93 IC12.27 | 92.08,50.93 90.04,50.93 89.53,51.44 86.23,51.44 85.85,51.05 76.58,51.05 76.45,50.93 74.68,50.93 IC10.27 | v61.34,15.88 61.72,15.88 62.23,15.37 IC3.13 | v58.04,31.62 57.91,31.75 v43.18,31.75 | v98.42,25.91 96.77,27.56 v93.34,27.56 71.88,27.56 71.75,27.43 v60.83,27.43 | v92.08,50.8 92.08,50.93
A9  (via drill 0.25)
  Top 0.203: J1.17 44.2,7.49 44.7,8 44.7,9.91 44.58,10.03 44.58,10.67 44.45,10.79 44.45,19.68 45.09,20.32 IC1.17 44.83,30.1 44.32,30.61 44.32,42.93 44.07,43.18 v44.07,46.35 | v71.88,49.53 71.25,48.9 v71.25,46.35 71.25,45.72 71.37,45.59 71.37,26.16 71.25,26.04 v71.25,17.27
  Bottom 0.203: IC12.26 92.71,49.66 90.04,49.66 89.53,50.16 87,50.16 86.87,50.04 85.98,50.04 85.6,49.66 74.68,49.66 IC10.26 v71.88,49.53 | 71.25,17.14 94.61,17.14 96.27,15.49 IC4.24 | 71.25,17.14 65.91,17.14 64.14,15.37 IC3.12 | v71.25,17.27 71.25,17.14 | v44.07,46.35 44.2,46.23 70.23,46.23 70.36,46.35 v71.25,46.35
A10  (via drill 0.25)
  Top 0.203: IC1.18 47.24,27.81 46.86,27.43 46.86,18.03 46.99,17.91 46.99,7.75 46.74,7.49 J1.18 | v89.03,46.35 88.27,45.59 v88.27,26.29 88.27,16.38 88.9,15.75 IC4.21
  Bottom 0.203: IC10.23 74.68,45.97 75.06,46.35 v89.03,46.35 90.93,46.35 91.57,45.72 IC12.23 | IC3.10 66.67,15.37 67.94,16.64 87.5,16.64 88.65,15.49 IC4.21 | v88.27,26.29 74.55,26.29 74.42,26.42 71.63,26.42 71.37,26.16 65.53,26.16 65.41,26.29 60.33,26.29 59.56,27.05 57.28,27.05 57.02,27.3 48.77,27.3 48.13,27.94 IC1.18
A11  (via drill 0.25)
  Top 0.203: 50.42,26.67 50.42,8.64 49.28,7.49 J1.19 | 50.42,26.67 50.42,27.69 IC1.19 | v71.88,16 v71.88,25.78 v71.88,48.26 | 50.42,26.67 v50.55,26.67
  Bottom 0.203: IC12.25 92.71,48.39 92.33,48.39 92.08,48.64 89.79,48.64 89.53,48.9 86.23,48.9 85.72,48.39 74.68,48.39 IC10.25 v71.88,48.26 | 72.58,15.3 73.41,16.13 79.63,16.13 80.64,15.11 80.64,13.08 93.09,13.08 93.73,13.72 IC4.23 | 72.58,15.3 70.23,12.95 68.45,12.95 67.94,13.46 IC3.9 | v71.88,16 72.58,15.3 | v50.55,26.67 50.67,26.54 59.18,26.54 59.94,25.78 65.28,25.78 65.41,25.65 71.75,25.65 v71.88,25.78
A12  (via drill 0.25)
  Top 0.203: v104.39,52.7 104.39,30.99 IC4.2 104.14,28.7 103.5,28.07 v103.5,21.46 | IC1.20 52.96,27.69 52.96,23.24 v53.21,22.99 51.18,20.95 51.18,7.49 J1.20
  Bottom 0.203: IC10.4 88.65,53.21 89.66,53.21 90.17,52.7 v104.39,52.7 106.3,52.7 106.68,53.09 IC12.4 | 65.22,22.29 64.52,22.99 v53.21,22.99 | 65.22,22.29 66.04,21.46 IC3.5 | v103.5,21.46 103.38,21.59 83.31,21.59 83.19,21.46 73.66,21.46 72.77,22.35 65.28,22.35 65.22,22.29
A13  (via drill 0.25)
  Top 0.203: v64.52,21.97 65.15,21.34 v65.15,18.29 | v53.09,30.99 53.09,42.8 52.96,42.93 IC1.21 | v57.4,27.81 58.04,27.18 v58.04,17.78 | v55.63,16.38 55.63,8.76 54.36,7.49 J1.21 | v99.06,52.07 100.97,50.16 100.97,16.38 101.6,15.75 IC4.26
  Bottom 0.203: IC10.28 74.68,52.32 75.06,52.7 89.53,52.7 90.04,52.2 92.71,52.2 IC12.28 v99.06,52.07 | v64.52,21.97 64.77,21.97 64.77,21.46 IC3.4 | IC4.26 101.35,15.49 98.81,18.03 65.41,18.03 v65.15,18.29 64.77,17.91 58.17,17.91 v58.04,17.78 57.91,17.65 56.9,17.65 v55.63,16.38 | v53.09,30.99 56.26,27.81 v57.4,27.81
A14  (via drill 0.25)
  Top 0.203: 51.05,34.54 51.05,29.97 51.18,29.84 v51.18,23.88 | 51.05,34.54 51.05,42.29 50.42,42.93 IC1.22 | v60.2,19.05 59.44,18.29 v59.44,11.68 | v56.26,10.67 56.26,7.49 J1.22 | v106.05,24.77 106.05,28.07 106.68,28.7 IC4.1 | v62.61,22.1 v62.61,24.64 62.48,24.77 62.48,31.11 v59.18,34.42 | 51.05,34.54 v52.45,34.54
  Bottom 0.203: 49.97,22.67 51.18,21.46 IC8.5 | 49.97,22.67 49.91,22.73 38.73,22.73 37.47,21.46 IC9.5 | 49.97,22.67 v51.18,23.88 | v60.2,19.05 61.72,19.05 62.23,19.56 IC3.2 62.61,21.46 v62.61,22.1 | v59.44,11.68 58.42,10.67 v56.26,10.67 | v106.05,24.77 74.8,24.77 74.68,24.89 72.52,24.89 72.26,24.64 v62.61,24.64 | v52.45,34.54 52.58,34.42 v59.18,34.42
A15  (via drill 0.25)
  Top 0.203: v36.07,22.61 36.32,22.86 v36.32,24.89 | v48.64,23.37 49.02,22.99 v49.02,22.1 49.15,21.97 49.15,10.79 v49.78,10.16 | v60.07,22.35 58.67,23.75 v58.67,24.64 58.8,24.77 v58.8,32.64 | v47.12,36.45 47.12,42.67 47.37,42.93 IC1.23 | v57.4,8.13 58.04,7.49 J1.23
  Bottom 0.203: v36.07,22.61 36.07,21.46 IC9.4 | v36.32,24.89 36.45,25.02 46.99,25.02 47.31,24.7 | 47.31,24.7 v48.64,23.37 | v49.02,22.1 49.15,21.97 49.4,21.97 49.91,21.46 IC8.4 | v60.07,22.35 60.96,21.46 IC3.1 | v58.67,24.64 58.55,24.77 47.37,24.77 47.31,24.7 | v47.12,36.45 47.5,36.07 49.02,36.07 50.16,34.92 50.16,33.91 57.53,33.91 v58.8,32.64 | v57.4,8.13 57.28,8.26 53.72,8.26 51.82,10.16 v49.78,10.16
AUX0  (via drill 0.25)
  Top 0.203: v51.69,36.45 51.69,61.21 49.53,61.21 48.51,60.2 IC2.14 | v53.72,35.43 53.85,35.31 53.85,20.95 52.2,19.3 52.2,13.72 52.7,13.21 v52.7,8.38
  Bottom 0.203: v51.69,36.45 52.7,35.43 v53.72,35.43 | v52.7,8.38 51.82,7.49 J1.41
BA
  Top 0.203: IC1.6 17.02,27.69 17.02,8.89 16.26,8.13 16.26,7.49 J1.6
BS
  Top 0.203: IC1.5 14.35,27.69 14.35,8.13 13.72,7.49 J1.5
CTSB
  Top 0.203: JP2.6 114.17,55.12 114.94,55.88 133.35,55.88 133.35,41.15 133.99,40.51 RN2.2
  Bottom 0.203: IC5.9 129.16,34.54 134.11,39.5 RN2.2
D0  (via drill 0.25)
  Top 0.203: v82.3,41.27 82.3,31.37 81.92,30.99 IC4.11 | v47.62,10.16 v47.62,12.83 | v36.7,10.79 36.7,22.61 36.96,22.86 36.96,27.43 36.32,28.07 v36.32,38.61 | v26.42,11.3 27.05,11.94 27.05,27.18 26.29,27.94 26.29,42.16 27.05,42.93 IC1.31 | v65.53,29.97 65.53,37.21 63.63,39.12 v63.63,48.39
  Bottom 0.203: v82.3,41.27 82.42,41.4 86.49,41.4 86.87,41.78 87.25,41.78 IC10.13 88.65,41.78 89.79,41.78 90.17,41.4 92.33,41.4 92.46,41.27 106.3,41.27 106.68,41.66 IC12.13 107.95,41.66 109.6,41.66 111.89,39.37 IC5.18 | v47.62,10.16 43.81,10.16 43.18,10.79 v36.7,10.79 | v36.32,38.61 34.8,40.13 30.86,40.13 27.81,43.18 IC1.31 27.81,45.09 31.37,48.64 54.36,48.64 54.48,48.51 58.55,48.51 58.8,48.26 63.5,48.26 v63.63,48.39 | v47.62,12.83 IC8.15 | v26.42,11.3 26.42,7.49 J1.51 | v65.53,29.97 67.56,27.94 71.63,27.94 71.75,28.07 80.14,28.07 81.03,28.96 IC4.11
D1  (via drill 0.25)
  Top 0.203: v107.31,31.62 111.89,36.2 IC5.19 | v42.8,18.8 42.93,18.67 v42.93,10.16 | v29.59,30.61 29.59,42.93 IC1.30 | v29.21,27.18 29.08,27.05 29.08,10.92 29.21,10.79 v29.21,10.16 | v78.74,36.58 78.74,30.99 IC4.12 | v67.44,38.48 66.55,39.37 66.55,46.99 66.67,47.12 v66.67,47.75
  Bottom 0.203: IC10.14 88.65,40.51 89.66,40.51 90.17,40.01 106.3,40.01 106.68,40.39 IC12.14 107.95,40.39 111.51,36.83 111.89,36.83 IC5.19 | v107.31,31.62 80.52,31.62 79.63,30.73 IC4.12 | v42.8,18.8 45.34,18.8 46.1,19.56 IC8.1 | v42.93,10.16 31.62,10.16 30.42,8.95 | 30.42,8.95 28.96,7.49 J1.50 | v29.59,30.61 28.83,29.84 28.83,27.18 v29.21,27.18 | 30.42,8.95 v29.21,10.16 | v78.74,36.58 77.85,37.47 69.09,37.47 68.07,38.48 v67.44,38.48 | v66.67,47.75 66.42,48.01 64.14,48.01 63.88,47.75 58.67,47.75 58.42,48.01 33.27,48.01 30.35,45.09 IC1.30
D2  (via drill 0.25)
  Top 0.203: v77.6,34.54 77.6,31.75 76.83,30.99 IC4.13 | v43.56,9.53 43.56,10.41 43.43,10.54 v43.43,21.97 43.81,22.35 43.81,38.99 v43.18,39.62 | v69.22,36.83 68.71,37.34 v68.71,40.26
  Bottom 0.203: 88.84,38.92 89.03,38.73 95.89,38.73 96.27,39.12 106.68,39.12 IC12.15 107.95,39.12 108.33,39.12 108.33,38.35 112.14,34.54 IC5.20 | 88.84,38.92 88.65,39.12 IC10.15 | 88.84,38.92 88.77,38.86 81.92,38.86 v77.6,34.54 75.31,36.83 v69.22,36.83 | v43.43,21.97 46.86,21.97 47.37,21.46 IC8.2 | v43.56,9.53 33.27,9.53 31.24,7.49 J1.49 | v43.18,39.62 42.61,40.2 | 42.61,40.2 40.26,42.55 33.53,42.55 32.89,43.18 IC1.29 | v68.71,40.26 42.67,40.26 42.61,40.2
D3  (via drill 0.25)
  Top 0.203: 75.44,32.77 75.44,18.8 74.3,17.65 74.3,15.75 IC4.15 | 75.44,32.77 75.44,37.85 v75.18,38.1 75.82,38.73 75.82,56.39 73.41,58.8 v73.41,60.45 | 75.44,32.77 v75.31,32.77 | v48.01,26.67 v48.01,22.1 | v36.32,26.67 35.43,25.78 35.43,18.41 35.94,17.91 35.94,9.4 v34.54,8 | v38.1,41.4 38.23,41.27 38.23,30.1 38.48,29.84 38.48,27.69 38.73,27.43 v38.73,26.67 | v54.99,60.33 53.72,59.05 v53.72,39.62
  Bottom 0.203: v75.18,38.1 IC10.17 | 96.52,37.59 105.66,37.59 111.51,31.75 111.89,31.75 IC5.21 | 96.52,37.59 94.23,37.59 93.98,37.85 IC12.17 | v75.31,32.77 91.69,32.77 96.52,37.59 | v48.01,22.1 48.64,21.46 IC8.3 | v48.01,26.67 47.88,26.54 38.73,26.54 | 38.73,26.54 36.45,26.54 v36.32,26.67 | v34.54,8 34.04,7.49 J1.48 | 38.73,26.54 v38.73,26.67 | IC1.28 34.42,45.09 33.78,45.72 32,45.72 31.37,45.09 31.37,41.4 34.8,41.4 34.92,41.27 37.97,41.27 v38.1,41.4 39.12,41.4 41.53,38.99 53.09,38.99 v53.72,39.62 | v73.41,60.45 72.9,60.96 57.28,60.96 56.52,60.2 55.12,60.2 v54.99,60.33
D4  (via drill 0.25)
  Top 0.203: v33.53,8.89 v33.53,12.57 31.75,14.35 31.75,26.16 v32.77,27.18 | v36.96,32.51 36.96,42.67 37.21,42.93 IC1.27 | v80.01,39.37 v80.01,32.13 80.01,18.92 76.83,15.75 IC4.16 | v66.04,47.37 v66.04,38.99
  Bottom 0.203: v33.53,12.57 33.53,13.46 IC9.15 | v33.53,8.89 33.78,8.64 34.8,8.64 35.94,7.49 J1.47 | v36.96,32.51 34.92,30.48 34.54,30.48 33.4,29.34 33.4,27.18 v32.77,27.18 | IC12.18 92.71,39.5 90.04,39.5 89.53,40.01 87,40.01 86.36,39.37 v80.01,39.37 IC10.18 73.28,39.12 66.17,39.12 v66.04,38.99 | v80.01,32.13 80.14,32.26 108.84,32.26 111.89,29.21 IC5.22 | v66.04,47.37 65.91,47.24 58.55,47.24 58.29,47.5 40.39,47.5 37.97,45.09 IC1.27
D5  (via drill 0.25)
  Top 0.203: v37.85,18.16 37.97,18.03 v37.97,8.13 | v70.61,45.72 70.87,45.47 70.87,40.89 v70.74,40.77 | v90.3,40.77 v90.3,28.19 90.3,12.7 80.64,12.7 79.63,13.72 IC4.17 | v32.38,23.62 33.4,24.64 v33.4,31.88 | v38.86,34.67 39.12,34.92 39.12,42.29 39.75,42.93 IC1.26
  Bottom 0.203: v37.85,18.16 37.21,18.8 33.15,18.8 32.38,19.56 IC9.1 32.38,21.46 v32.38,23.62 | v37.97,8.13 37.97,7.49 J1.46 | IC12.19 92.71,40.77 v90.3,40.77 90.17,40.77 89.66,41.27 87,41.27 86.36,40.64 IC10.19 73.28,40.77 v70.74,40.77 | v70.61,45.72 41.15,45.72 40.51,45.09 IC1.26 | v90.3,28.19 110.36,28.19 111.89,26.67 IC5.23 | v33.4,31.88 36.2,34.67 v38.86,34.67
D6  (via drill 0.25)
  Top 0.203: IC1.25 42.29,42.93 42.29,40.01 41.53,39.24 41.53,25.27 v40.64,24.38 40.77,24.26 v40.77,8.26 | v80.64,41.91 v80.64,22.86 80.64,16.38 81.28,15.75 IC4.18 | v69.22,40.77 v69.22,42.04
  Bottom 0.203: v40.64,24.38 40.01,23.75 33.66,23.75 33.66,21.46 IC9.2 | v40.77,8.26 40.77,7.49 J1.45 | IC12.20 92.71,42.04 92.33,42.04 91.82,42.55 87,42.55 86.36,41.91 v80.64,41.91 IC10.20 73.28,42.04 v69.22,42.04 | v80.64,22.86 111.25,22.86 111.89,23.5 IC5.24 | v69.22,40.77 69.09,40.89 68.45,40.89 68.33,40.77 45.47,40.77 43.05,43.18 IC1.25
D7  (via drill 0.25)
  Top 0.203: v45.72,24.38 46.1,24.77 46.1,32.89 45.34,33.66 45.34,42.93 IC1.24 45.34,45.34 45.72,45.72 v45.72,46.86 | v44.07,8.26 44.2,8.38 44.2,9.78 44.07,9.91 44.07,10.54 43.94,10.67 43.94,21.59 44.45,22.1 v44.45,23.37 | v82.93,43.81 v82.93,22.1 82.93,16.64 83.82,15.75 IC4.19
  Bottom 0.203: 44.64,23.3 v45.72,24.38 | 44.64,23.3 44.58,23.24 34.92,23.24 34.92,21.46 IC9.3 | v44.07,8.26 44.07,7.49 J1.44 | v44.45,23.37 44.58,23.37 44.64,23.3 | 76.2,43.81 v82.93,43.81 91.82,43.81 92.33,43.31 92.71,43.31 IC12.21 | 76.2,43.81 75.06,43.81 74.68,43.43 IC10.21 | v82.93,22.1 111.38,22.1 111.89,21.59 IC5.25 | v45.72,46.86 45.85,46.74 70.1,46.74 70.36,46.99 71.5,46.99 72.9,45.59 72.9,45.09 74.93,45.09 76.2,43.81
DCDB
  Bottom 0.203: IC5.16 114.17,44.45 114.55,44.83 126.87,44.83 127.13,45.09 RN2.4
DSRB
  Bottom 0.203: IC5.17 114.17,41.27 114.81,40.64 132.08,40.64 133.73,42.29 RN2.3
E14  (via drill 0.25)
  Top 0.203: v60.07,15.62 61.85,13.84 61.85,12.7 | 61.85,12.7 61.85,7.49 J1.24 | v86.61,54.48 79.38,47.24 v79.38,35.43 | v69.22,34.04 67.82,32.64 v67.82,12.7 | 61.85,12.7 v62.36,12.7
  Bottom 0.203: IC12.3 106.68,54.36 106.3,53.98 90.17,53.98 89.66,54.48 88.65,54.48 IC10.3 87.25,54.48 v86.61,54.48 | v60.07,15.62 59.31,15.62 56.64,12.95 54.74,12.95 54.23,13.46 IC8.10 | v79.38,35.43 77.85,33.91 69.34,33.91 v69.22,34.04 | v62.36,12.7 v67.82,12.7
E15  (via drill 0.25)
  Top 0.203: v62.61,16.51 63.5,15.62 v63.5,10.16 63.5,7.49 J1.25 | v98.42,55.88 98.42,26.8 100.33,24.89 100.33,13.46 96.9,10.03 v76.07,10.03
  Bottom 0.203: IC10.31 74.68,56.13 75.06,56.52 91.82,56.52 92.33,56.01 92.71,56.01 IC12.31 v98.42,55.88 | v62.61,16.51 56.64,16.51 55.5,15.37 IC8.9 | v76.07,10.03 75.95,10.16 v63.5,10.16
E16  (via drill 0.25)
  Top 0.203: v57.4,21.97 57.4,12.83 v60.83,9.4 | v66.42,9.4 66.42,7.49 J1.26 | v86.74,55.88 78.11,47.24 78.11,34.92 78.23,34.8 78.23,31.11 77.72,30.61 77.72,17.91 75.44,15.62 75.44,12.7 v72.26,9.53
  Bottom 0.203: IC12.2 106.68,55.63 106.3,55.24 92.46,55.24 91.95,55.75 88.65,55.75 IC10.2 v86.74,55.88 | v57.4,21.97 54.74,21.97 54.23,21.46 IC8.7 | v60.83,9.4 v66.42,9.4 66.55,9.53 v72.26,9.53
E17  (via drill 0.25)
  Top 0.203: v52.96,18.67 53.09,18.54 53.09,13.46 54.99,11.56 v54.99,10.16 | v67.06,8.76 68.2,7.62 68.2,7.49 J1.27 69.6,7.49 69.6,7.75 74.93,13.08 74.93,17.65 v77.09,19.81 | v97.79,56.52 97.79,25.4 v93.34,20.95
  Bottom 0.203: IC10.1 88.65,57.02 91.95,57.02 92.46,56.52 v97.79,56.52 106.3,56.52 106.68,56.9 IC12.1 | v52.96,18.67 52.96,19.56 IC8.6 | v54.99,10.16 56.39,8.76 v67.06,8.76 | v93.34,20.95 92.2,19.81 v77.09,19.81
E18  (via drill 0.25)
  Top 0.203: v53.72,17.14 54.36,17.78 56.39,17.78 56.39,21.34 56.26,21.46 v56.26,58.29 | v68.2,8.89 67.18,9.91 67.18,31.24 67.31,31.37 v67.31,34.04 | v74.3,36.2 74.55,36.45 74.55,53.85 v75.18,54.48
  Bottom 0.203: IC10.30 74.68,54.86 75.06,55.24 91.19,55.24 91.69,54.74 92.71,54.74 IC12.30 | v53.72,17.14 50.8,17.14 50.8,13.08 50.67,12.95 48.26,12.95 48.26,15.75 40.39,15.75 40.01,15.37 IC9.10 | v56.26,58.29 56.39,58.42 61.47,58.42 61.59,58.29 61.59,54.61 IC10.30 | v68.2,8.89 68.2,7.49 J1.34 | v67.31,34.04 69.47,36.2 v74.3,36.2 | v75.18,54.48 74.68,54.48 IC10.30
E19  (via drill 0.25)
  Top 0.203: v39.5,12.83 39.5,27.43 38.99,27.94 38.99,31.11 v40.26,32.38 | v65.79,26.8 v65.79,8.13
  Bottom 0.203: v39.5,12.83 40.01,12.83 40.64,13.46 IC9.9 | v40.26,32.38 41.27,33.4 57.15,33.4 58.8,31.75 58.8,27.56 59.69,27.56 60.45,26.8 v65.79,26.8 | v65.79,8.13 65.79,7.49 J1.35
E20  (via drill 0.25)
  Top 0.203: v45.09,18.16 45.21,18.03 v45.21,10.79 | v62.61,8 62.61,9.91 v62.48,10.03 62.99,10.54 62.99,13.34 61.98,14.35 61.98,29.08 v61.47,29.59 | v58.93,55.75 60.33,55.75 60.33,35.94 v61.21,35.05
  Bottom 0.203: v45.09,18.16 41.4,18.16 40.01,19.56 IC9.7 | v45.21,10.79 55.24,10.79 56.01,10.03 v62.48,10.03 | v62.61,8 63.12,7.49 J1.36 | v58.93,55.75 59.05,55.75 59.44,56.13 IC7.1 | v61.21,35.05 61.21,29.59 v61.47,29.59
E21  (via drill 0.25)
  Top 0.203: v38.1,19.05 v38.1,27.18 | v59.44,55.12 59.44,53.72 58.55,52.83 58.55,34.42 v56.9,32.77 56.77,32.64 56.77,21.59 56.9,21.46 56.9,10.41 v59.18,8.13
  Bottom 0.203: v38.1,19.05 38.1,19.56 IC9.6 | v38.1,27.18 38.1,27.56 38.99,28.45 38.99,31.75 42.29,31.75 43.31,32.77 v56.9,32.77 | v59.44,55.12 59.94,55.63 60.2,55.63 60.71,56.13 IC7.2 | v59.18,8.13 59.94,8.13 60.58,7.49 J1.37
ECLK  (via drill 0.25)
  Top 0.203: IC1.34 19.94,45.34 22.35,47.75 22.35,50.55 IC2.1 23.11,51.82 24.51,51.82 IC2.2 | v73.28,61.47 96.52,61.47 105.41,52.58 105.41,23.5 112.14,16.76 IC5.27 | v12.83,11.81 11.81,12.83 11.81,27.18 11.05,27.94 11.05,36.07 v12.95,37.97
  Bottom 0.203: v73.28,61.47 30.23,61.47 28.57,59.82 28.57,53.34 26.42,53.34 25.65,52.58 IC2.2 | v12.83,11.81 18.03,11.81 18.03,7.49 J1.54 | v12.95,37.97 18.16,43.18 19.18,43.18 IC1.34
GND  (via drill 0.3)
  Top 0.61: 125.86,48.9 v124.71,47.75 | 125.86,48.9 125.86,52.58 JP2.1 | v96.27,38.23 v95,36.96 | 125.86,48.9 126.11,48.77 132.72,48.77 132.72,39.24 133.99,37.97 RN2.1 | J1.1 2.92,7.49 2.92,13.46 C7.2 3.43,14.48 4.06,15.11 4.06,27.81 IC1.1 4.19,30.1 3.3,30.99 v3.3,45.85 | v67.94,44.58 67.94,47.62 66.74,48.83 | 66.74,48.83 66.29,49.28 v65.66,49.28 | v67.06,55.24 66.93,55.12 66.93,49.02 66.74,48.83 | 45.85,17.65 45.85,18.67 v45.09,19.43 | 45.85,17.65 v45.85,12.83 | v58.8,19.05 v58.8,13.34 | v46.35,17.65 45.85,17.65 | IC4.14 73.66,28.7 73.66,22.86 v72.52,21.72 72.64,21.46 72.64,13.21 v73.41,12.45 | v64.26,31.11 64.26,33.4 v64.9,34.04 64.77,34.29 62.87,36.2 62.87,48.51 v62.48,48.9 | v75.31,11.68 75.31,8 75.82,7.49 J1.30 | v49.78,17.91 49.78,26.92 49.02,27.69 49.02,35.43 | 49.02,35.43 v49.02,38.1 | v48.77,35.43 49.02,35.43
  Bottom 0.61: v124.71,47.75 118.49,47.75 117.98,47.24 C8.2 | C18.1 96.01,59.94 97.03,58.93 121.54,58.93 125.48,54.99 JP2.1 | v95,36.96 89.53,36.96 88.65,37.85 IC10.16 | v96.27,38.23 106.68,38.23 IC12.16 107.95,37.85 107.95,36.2 111.38,32.77 135.89,32.77 | 135.89,32.77 135.89,30.48 137.29,30.48 137.92,29.84 C10.1 138.18,28.96 138.18,25.02 C9.1 137.67,24.13 137.67,20.19 129.54,20.19 129.41,19.94 | 135.89,32.77 135.89,36.96 RN2.1 | 129.41,19.94 127.13,19.94 124.71,17.53 111.89,17.53 110.87,18.54 107.7,18.54 107.57,18.67 C6.1 106.68,19.05 75.06,19.05 72.64,21.46 v72.52,21.72 69.47,21.72 69.22,21.46 IC3.7 | 129.41,19.94 130.05,19.3 130.05,14.22 129.16,14.22 IC5.1 | C13.2 30.1,12.83 4.57,12.83 3.68,13.72 C7.2 | 3.3,56.13 5.97,56.13 C2.1 6.73,55.63 10.67,55.63 C1.1 11.56,56.13 18.67,56.13 19.43,56.9 C4.1 | 3.3,56.13 2.92,56.13 2.92,61.21 3.56,61.85 9.91,61.85 9.91,60.71 R2.1 | IC6.1 9.78,40.13 8.38,40.13 C11.2 7.49,39.24 7.37,39.12 7.11,39.12 6.86,38.86 6.86,33.02 7.75,33.02 7.87,32.77 | 7.87,32.77 19.3,32.77 19.43,32.89 C3.2 20.32,33.91 21.84,35.43 v48.77,35.43 | 7.87,32.77 4.95,29.84 IC1.1 | v3.3,45.85 3.3,56.13 | IC7.4 63.75,57.15 64.52,57.15 IC7.5 65.02,58.04 65.02,58.67 66.8,58.67 67.31,58.17 67.56,58.04 | 67.56,58.04 75.82,58.04 75.82,59.94 C5.1 | 67.56,58.04 IC7.7 67.06,56.13 v67.06,55.24 | IC7.10 65.02,50.93 65.79,50.93 IC7.9 | v65.66,49.28 65.02,49.91 IC7.10 | v67.94,44.58 IC11.8 | 60.52,52.26 60.96,51.82 IC7.13 61.21,50.93 61.98,50.93 IC7.12 62.48,49.91 v62.48,48.9 | 60.52,52.26 60.07,52.7 57.53,52.7 C17.2 56.77,52.7 51.18,52.7 51.05,52.58 IC2.12 | IC7.10 64.52,51.82 64.52,52.45 60.71,52.45 60.52,52.26
  Bottom 0.61: v45.85,12.83 45.21,12.83 C14.2 | v45.09,19.43 44.96,19.56 41.27,19.56 IC9.8 | v58.8,13.34 59.44,13.34 C15.2 | v58.8,19.05 58.29,19.56 55.5,19.56 | 55.5,19.56 IC8.8 | v46.35,17.65 46.61,17.91 v49.78,17.91 53.72,17.91 55.24,19.43 55.5,19.56 | 64.71,30.67 63.88,29.84 63.12,29.84 C12.2 62.23,28.83 60.45,28.83 T1.E | 64.71,30.67 64.9,30.86 XO1.GND 65.79,30.86 68.07,28.57 71.37,28.57 71.75,28.96 73.41,28.96 IC4.14 | v64.9,34.04 65.15,34.04 65.15,35.69 IC11.11 65.41,37.59 63.88,39.12 57.53,39.12 C16.2 56.77,38.48 56.64,38.35 49.28,38.35 v49.02,38.1 | v64.26,31.11 64.71,30.67 | v75.31,11.68 74.55,12.45 v73.41,12.45
  pour Top (isolate 0.305): 0,63.5 139.7,63.5 139.7,0 0,0
  pour Bottom (isolate 0.305): 0,63.5 139.7,63.5 139.7,7.94 0,7.94
HIADR  (via drill 0.25)
  Top 0.203: v54.99,58.93 54.99,56.26 55.63,55.63 v55.63,53.59
  Bottom 0.203: v54.99,58.93 62.1,58.93 62.1,58.04 IC7.3 | v55.63,53.59 55.37,53.34 31.5,53.34 30.73,52.58 IC2.4
HN2  (via drill 0.25)
  Top 0.203: v69.22,16 v69.22,29.34 | v72.52,31.5 72.9,31.88 72.9,46.48 73.15,46.74 73.15,51.05 v72.14,52.07 | v48.51,53.98 48.13,53.59 48.13,52.96 IC2.11
  Bottom 0.203: v69.22,16 69.22,15.37 IC3.8 | v69.22,29.34 71.37,31.5 v72.52,31.5 | v72.14,52.07 70.1,54.1 59.56,54.1 59.05,54.61 55.75,54.61 55.12,53.98 v48.51,53.98
HN3  (via drill 0.25)
  Top 0.203: v55.75,18.41 54.36,19.81 v54.36,58.29
  Bottom 0.203: v55.75,18.41 61.72,18.41 62.23,18.92 66.67,18.92 67.31,19.56 IC3.6 | v54.36,58.29 54.1,58.55 51.05,58.55 IC2.13
IO  (via drill 0.25)
  Top 0.203: v28.57,10.54 28.57,52.2 34.16,57.78 34.16,61.21 38.73,61.21 39.75,60.2 IC2.17 | v45.97,11.43 v45.97,8.13
  Bottom 0.203: v28.57,10.54 29.46,11.43 v45.97,11.43 | v45.97,8.13 45.97,7.49 J1.43
N$1
  Bottom 0.203: R1.2 60.33,30.73 T1.B
N$2
  Bottom 0.203: R2.2 8.13,60.45 7.24,60.45 PWR.K
N$3
  Bottom 0.203: R1.1 IC11.15
N$5  (via drill 0.25)
  Top 0.203: v66.67,31.62 v66.67,35.05
  Bottom 0.203: v66.67,31.62 67.44,31.62 67.56,31.5 XO1.CKOUT | v66.67,35.05 IC11.10
N$20
  Bottom 0.203: C9.2 136.02,24.64 134.75,24.64 Q2.2 133.6,24.89 130.56,24.89 129.41,26.04 IC5.6
N$21
  Top 0.203: IC5.7 129.41,29.08 133.6,29.08 Q2.1
  Bottom 0.203: C10.2 136.02,29.34 134.75,29.34 Q2.1
QCLK  (via drill 0.25)
  Top 0.203: v17.65,21.72 18.16,22.23 18.16,29.84 17.91,30.1 17.91,42.42 17.4,42.93 IC1.35 | v16.38,14.73 16.13,14.48 16.13,8.64 v15.62,8.13
  Bottom 0.203: v17.65,21.72 16.89,20.95 16.89,14.73 v16.38,14.73 | v15.62,8.13 15.62,7.49 J1.55
R//W  (via drill 0.25)
  Top 0.203: IC2.3 27.43,50.55 27.43,47.75 25.02,45.34 IC1.32 25.02,42.93 25.78,42.16 25.78,22.1 25.02,21.34 v25.02,8.64
  Bottom 0.203: v25.02,8.64 23.88,7.49 J1.52
RTSB
  Top 0.203: IC5.8 127.38,32 124.08,35.31 124.08,52.58 JP2.2
RXD
  Bottom 0.203: IC5.12 129.41,41.91 131.57,44.07 135.89,44.07 136.53,44.7 136.53,47.12 135.89,47.12 RN2.5 133.73,47.88 133.22,48.39 123.7,48.39 119.25,52.83 JP2.4
TXD
  Top 0.203: IC5.10 129.16,35.94 129.79,35.31 129.79,30.86 129.41,30.48 116.46,30.48 116.46,52.58 JP2.5
VCC  (via drill 0.3)
  Top 0.61: v42.29,16.89 v42.29,15.11 | 19.56,13.97 19.56,8.26 18.8,7.49 J1.7 | 19.56,13.97 19.56,27.69 IC1.7 19.43,30.1 18.54,30.99 v18.54,37.47 18.54,54.36 22.35,58.17 IC2.24 | v19.3,13.97 19.56,13.97 | 114.81,15.88 127.13,15.88 IC5.2 | 114.81,15.88 114.81,15.62 114.17,14.99 107.57,14.99 IC4.28 106.43,13.72 v103.25,10.54 | 114.81,15.88 114.81,45.21 113.92,46.1 IC5.15 | v59.44,48.9 v59.44,38.23 59.56,37.97 59.56,35.56 v62.23,32.89 62.36,32.64 63.37,31.62 63.37,21.97 64.14,21.21 v64.14,12.06
  Bottom 0.61: IC8.16 46.1,14.48 45.21,14.48 C14.1 44.32,14.99 44.2,15.11 v42.29,15.11 | 25.91,19.18 30.1,14.99 C13.1 30.86,14.48 31.75,14.48 IC9.16 32.13,15.37 33.66,16.89 v42.29,16.89 | 25.91,19.18 RN1.1 | C7.1 v19.3,13.97 20.57,13.97 25.65,19.05 25.91,19.18 | IC2.24 21.97,59.18 20.32,59.18 C4.2 19.43,59.31 5.84,59.31 4.7,60.45 PWR.A | C3.1 19.94,31.24 19.94,30.1 IC1.7 | C6.2 107.19,16.89 107.19,15.75 IC4.28 | C8.1 115.32,46.86 114.17,46.86 IC5.15 112.14,47.24 112.14,56.01 | 112.14,56.01 119.38,56.01 120.4,54.99 JP2.3 | 93.73,58.04 93.73,57.4 IC12.32 92.71,57.4 92.08,58.04 77.34,58.04 | 93.73,58.04 93.73,59.94 C18.2 | 77.34,58.04 77.34,57.15 IC10.32 | 77.34,58.04 77.34,61.09 77.09,61.34 75.06,61.34 75.06,60.71 C5.2 | 112.14,56.01 111.89,56.13 109.98,58.04 93.73,58.04 | C15.1 60.33,14.48 60.96,14.48 IC3.14 61.59,13.46 61.59,10.92 64.14,10.92 | 64.14,10.92 74.8,10.92 74.93,10.79 76.45,10.79 76.83,10.41 | 76.83,10.41 76.83,7.49 J1.31 | XO1.VDD 67.56,32.38 65.79,32.38 XO1.OE 64.9,32.13 63.75,32.13 63.12,31.5 C12.1 62.23,31.5 v62.23,32.89 | C17.1 57.53,51.56 59.44,51.56 IC7.14 59.44,49.91 v59.44,48.9 | C11.1 8.38,38.1 10.67,38.1 IC6.3 11.56,37.97 12.32,37.21 18.54,37.21 | 18.54,37.21 56.77,37.21 C16.1 57.53,37.21 58.8,37.21 IC11.16 59.31,37.59 59.44,37.59 v59.44,38.23 | v64.14,12.06 64.14,10.92 | v103.25,10.54 77.09,10.54 76.83,10.41 | v18.54,37.47 18.54,37.21
X1
  Top 0.203: IC1.39 6.73,45.34 6.6,45.47 6.6,50.29 Q1.1
  Bottom 0.203: C2.2 6.35,51.31 Q1.1
X2
  Top 0.203: IC1.38 9.78,45.34 10.79,46.35 10.79,50.29 Q1.2
  Bottom 0.203: C1.2 11.18,53.47 11.18,51.31 Q1.2
XMEM  (via drill 0.25)
  Top 0.203: v40.26,56.26 36.2,52.2 36.2,49.78 33.91,47.5 33.91,43.18 v35.18,41.91 | v41.66,40.26 40.89,39.5 v40.89,30.48 | v47.5,27.18 47.37,27.05 47.37,18.16 48.26,17.27 v48.26,8.13
  Bottom 0.203: v40.26,56.26 42.42,58.42 IC2.16 | v35.18,41.91 35.31,42.04 39.88,42.04 v41.66,40.26 | v40.89,30.48 45.47,30.48 46.61,29.34 46.61,27.18 v47.5,27.18 | v48.26,8.13 48.26,7.49 J1.42

### Text on the board
tPlace: Pugputer 6309 - CPU v2